# EAGLE design power electronics6 (EAGLE 9.2.2)
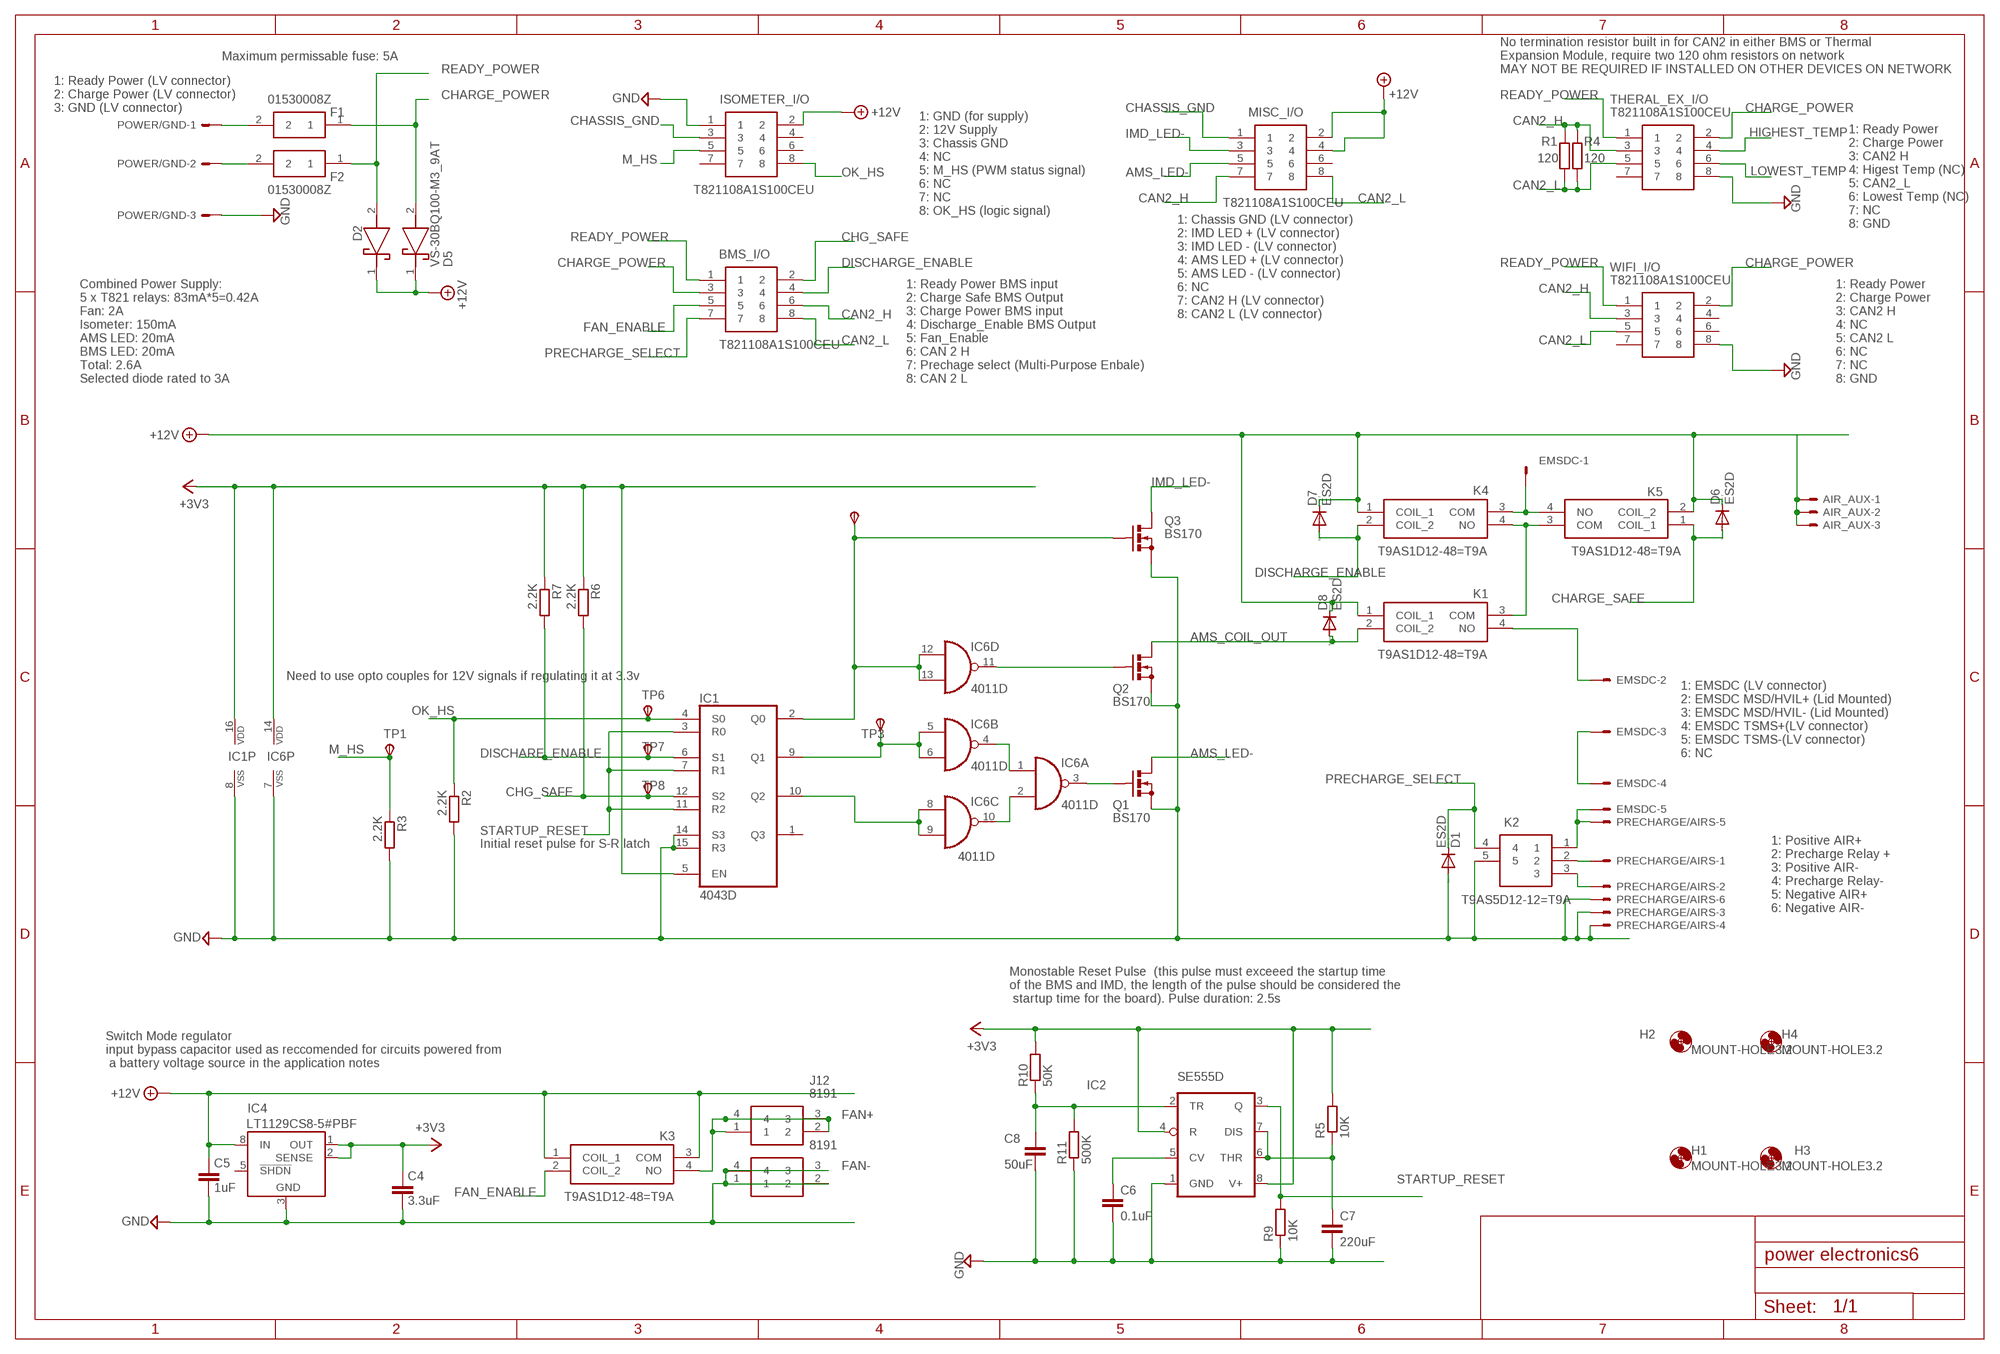
[diagram p0: schematic, sheet 1]

## Parts
AIR_AUX  KK-156-3  [KK-156-3]
BMS_I/O  T821108A1S100CEU  [HDRV8W64P254_2X4_1778X895X915P]
C4  3.3uF  C-EUC1206  [C1206]
C5  1uF  C-EUC1206  [C1206]
C6  0.1uF  C-EUC1206  [C1206]
C7  220uF  C-EUC1206  [C1206]
C8  50uF  C-EUC1206  [C1206]
D1  ES2D  [SMB]
D2  VS-30BQ100-M3_9AT  [DIOM7959X262N]
D5  VS-30BQ100-M3_9AT  [DIOM7959X262N]
D6  ES2D  [SMB]
D7  ES2D  [SMB]
D8  ES2D  [SMB]
EMSDC  KK-156-6  [KK-156-6]
F1  01530008Z  [01530008]
F2  01530008Z  [01530008]
FAN-  8191  [8191]
H1  MOUNT-HOLE3.2  [3,2]
H2  MOUNT-HOLE3.2  [3,2]
H3  MOUNT-HOLE3.2  [3,2]
H4  MOUNT-HOLE3.2  [3,2]
IC1  4043D  [SO16]
IC2  SE555D  [SO08]
IC4  LT1129CS8  [SOIC8]
IC6  4011D  [SO14]
ISOMETER_I/O  T821108A1S100CEU  [HDRV8W64P254_2X4_1778X895X915P]
J12  8191  [8191]
K1  T9AS1D12-48=T9A  [T9AS1D1248T9A]
K2  T9AS5D12-12=T9A  [T9AS1D12]
K3  T9AS1D12-48=T9A  [T9AS1D1248T9A]
K4  T9AS1D12-48=T9A  [T9AS1D1248T9A]
K5  T9AS1D12-48=T9A  [T9AS1D1248T9A]
MISC_I/O  T821108A1S100CEU  [HDRV8W64P254_2X4_1778X895X915P]
POWER/GND  KK-156-3  [KK-156-3]
PRECHARGE/AIRS  KK-156-6  [KK-156-6]
Q1  BS170  [SOT54E]
Q2  BS170  [SOT54E]
Q3  BS170  [SOT54E]
R1  120  R-EU_R1206  [R1206]
R2  2.2K  R-EU_R1206  [R1206]
R3  2.2K  R-EU_R1206  [R1206]
R4  120  R-EU_R1206  [R1206]
R5  10K  R-EU_R1206  [R1206]
R6  2.2K  R-EU_R1206  [R1206]
R7  2.2K  R-EU_R1206  [R1206]
R9  10K  R-EU_R1206  [R1206]
R10  50K  R-EU_R1206  [R1206]
R11  500K  R-EU_R1206  [R1206]
THERAL_EX_I/O  T821108A1S100CEU  [HDRV8W64P254_2X4_1778X895X915P]
TP1  TPSPAD1-17  [P1-17]
TP2  TPSPAD1-17  [P1-17]
TP3  TPSPAD1-17  [P1-17]
TP6  TPSPAD1-17  [P1-17]
TP7  TPSPAD1-17  [P1-17]
TP8  TPSPAD1-17  [P1-17]
WIFI_I/O  T821108A1S100CEU  [HDRV8W64P254_2X4_1778X895X915P]

## Nets
+3V3: C4.1 IC1.5(EN) IC1.16(VDD) IC2.4(R) IC2.8(V+) IC4.1(OUT) IC4.2(SENSE) IC6.14(P:VDD) R5.2 R6.1 R7.1 R10.2
+12V: AIR_AUX.1 AIR_AUX.2 AIR_AUX.3 C5.1 D2.1(K) D5.1(K) D6.C D7.C D8.C IC4.8(IN) ISOMETER_I/O.2 K1.1(COIL_1) K3.1(COIL_1) K3.3(COM) K4.1(COIL_1) K5.2(COIL_2) MISC_I/O.2 MISC_I/O.4
AMS_COIL_OUT: D8.A K1.2(COIL_2) Q2.D
AMS_LED-: MISC_I/O.5 Q1.D
CAN2_H: BMS_I/O.6 MISC_I/O.7 R1.1 R4.1 THERAL_EX_I/O.3 WIFI_I/O.3
CAN2_L: BMS_I/O.8 MISC_I/O.8 R1.2 R4.2 THERAL_EX_I/O.5 WIFI_I/O.5
CHARGE_POWER: BMS_I/O.3 D5.2(A) F1.1 THERAL_EX_I/O.2 WIFI_I/O.2
CHARGE_SAFE: D6.A K5.1(COIL_1)
CHASSIS_GND: ISOMETER_I/O.3 MISC_I/O.1
CHG_SAFE: BMS_I/O.2 IC1.12(S2) R6.2 TP8.TP(PP)
DISCHARE_ENABLE: IC1.6(S1) R7.2 TP7.TP(PP)
DISCHARGE_ENABLE: BMS_I/O.4 D7.A K4.2(COIL_2)
EMSDC_IMD+: K1.3(COM) K4.4(NO) K5.3(COM)
FAN+: J12.1 J12.2 J12.3 J12.4 K3.4(NO)
FAN_ENABLE: BMS_I/O.5 K3.2(COIL_2)
GND: C4.2 C5.2 C6.2 C7.2 C8.2 D1.A FAN-.1 FAN-.2 FAN-.3 FAN-.4 IC1.8(VSS) IC1.14(S3) IC1.15(R3) IC2.1(GND) IC4.3(GND) IC6.7(P:VSS) ISOMETER_I/O.1 K2.5 POWER/GND.3 PRECHARGE/AIRS.3 PRECHARGE/AIRS.4 PRECHARGE/AIRS.6 Q1.S Q2.S Q3.S R2.2 R3.2 R9.1 R11.1 THERAL_EX_I/O.8 WIFI_I/O.8
HIGHEST_TEMP: THERAL_EX_I/O.4
IMD_LED-: MISC_I/O.3 Q3.D
LOWEST_TEMP: THERAL_EX_I/O.6
M_HS: ISOMETER_I/O.5 R3.1 TP1.TP(PP)
N$1: EMSDC.1 K4.3(COM) K5.4(NO)
N$2: F2.2 POWER/GND.2
N$3: K2.2 PRECHARGE/AIRS.1
N$4: F1.2 POWER/GND.1
N$8: IC1.2(Q0) IC6.12(D:I0) IC6.13(D:I1) Q3.G TP2.TP(PP)
N$10: IC1.9(Q1) IC6.5(B:I0) IC6.6(B:I1) TP3.TP(PP)
N$11: EMSDC.5 K2.1 PRECHARGE/AIRS.5
N$12: K2.3 PRECHARGE/AIRS.2
N$13: IC1.10(Q2) IC6.8(C:I0) IC6.9(C:I1)
N$14: IC6.1(A:I0) IC6.4(B:O)
N$15: EMSDC.2 K1.4(NO)
N$17: C7.1 IC2.6(THR) IC2.7(DIS) R5.1
N$19: EMSDC.3 EMSDC.4
N$20: IC6.2(A:I1) IC6.10(C:O)
N$21: IC6.3(A:O) Q1.G
N$28: C8.1 IC2.2(TR) R10.1 R11.2
N$32: C6.1 IC2.5(CV)
N$37: IC6.11(D:O) Q2.G
OK_HS: IC1.4(S0) ISOMETER_I/O.8 R2.1 TP6.TP(PP)
PRECHARGE_SELECT: BMS_I/O.7 D1.C K2.4
READY_POWER: BMS_I/O.1 D2.2(A) F2.1 THERAL_EX_I/O.1 WIFI_I/O.1
STARTUP_RESET: IC1.3(R0) IC1.7(R1) IC1.11(R2) IC2.3(Q) R9.2
Unconnected: EMSDC.6 IC1.1(Q3) IC4.4(NC) IC4.5(!SHDN) ISOMETER_I/O.4 ISOMETER_I/O.6 ISOMETER_I/O.7 MISC_I/O.6 THERAL_EX_I/O.7 WIFI_I/O.4 WIFI_I/O.6 WIFI_I/O.7

## Notes on the sheet
- Maximum permissable fuse: 5A
- No termination resistor built in for CAN2 in either BMS or Thermal
  Expansion Module, require two 120 ohm resistors on network
  MAY NOT BE REQUIRED IF INSTALLED ON OTHER DEVICES ON NETWORK
- 1: Ready Power (LV connector)
  2: Charge Power (LV connector)
  3: GND (LV connector)
- 1: GND (for supply) 
  2: 12V Supply
  3: Chassis GND 
  4: NC 
  5: M_HS (PWM status signal)
  6: NC
  7: NC
  8: OK_HS (logic signal)
- 1: Ready Power
  2: Charge Power
  3: CAN2 H
  4: Higest Temp (NC)
  5: CAN2_L
  6: Lowest Temp (NC)
  7: NC
  8: GND
- 1: Chassis GND (LV connector)
  2: IMD LED + (LV connector)
  3: IMD LED - (LV connector)
  4: AMS LED + (LV connector)
  5: AMS LED - (LV connector)
  6: NC
  7: CAN2 H (LV connector)
  8: CAN2 L (LV connector)
- Combined Power Supply:
  5 x T821 relays: 83mA*5=0.42A
  Fan: 2A
  Isometer: 150mA
  AMS LED: 20mA
  BMS LED: 20mA
  Total: 2.6A
  Selected diode rated to 3A
- 1: Ready Power BMS input
  2: Charge Safe BMS Output 
  3: Charge Power BMS input
  4: Discharge_Enable BMS Output
  5: Fan_Enable
  6: CAN 2 H
  7: Prechage select (Multi-Purpose Enbale)
  8: CAN 2 L
- 1: Ready Power
  2: Charge Power
  3: CAN2 H
  4: NC
  5: CAN2 L
  6: NC
  7: NC
  8: GND
- Need to use opto couples for 12V signals if regulating it at 3.3v
- 1: EMSDC (LV connector)
  2: EMSDC MSD/HVIL+ (Lid Mounted)
  3: EMSDC MSD/HVIL- (Lid Mounted)
  4: EMSDC TSMS+(LV connector)
  5: EMSDC TSMS-(LV connector)
  6: NC
- Initial reset pulse for S-R latch
- 1: Positive AIR+
  2: Precharge Relay +
  3: Positive AIR-
  4: Precharge Relay-
  5: Negative AIR+
  6: Negative AIR-
- Monostable Reset Pulse  (this pulse must exceeed the startup time 
  of the BMS and IMD, the length of the pulse should be considered the
   startup time for the board). Pulse duration: 2.5s
- Switch Mode regulator
  input bypass capacitor used as reccomended for circuits powered from
   a battery voltage source in the application notes

## Power pins joined to a net without a drawn wire
GND: IC4.6(GND) IC4.7(GND)

## Library data of the parts
AIR_AUX POWER/GND = con-molex:KK-156-3: KK 156 HEADER Source: http://www.molex.com/pdm_docs/sd/026604100_sd.pdf; MF: MOLEX; OC_FARNELL: unknown; OC_NEWARK: unknown
BMS_I/O ISOMETER_I/O MISC_I/O THERAL_EX_I/O WIFI_I/O = SamacSys_Parts:T821108A1S100CEU: HEADER, VERTICAL, 2.54MM, 8WAY Amphenol T821 Series, 2.54mm Pitch 8 Way 2 Row Straight PCB Header, Solder Termination, 3A Source: Datasheet <http://uk.rs-online.com/web/p/products/8323569>; DESCRIPTION: HEADER, VERTICAL, 2.54MM, 8WAY Amphenol T821 Series, 2.54mm Pitch 8 Way 2 Row Straight PCB Header, Solder Termination, 3A; HEIGHT: 9.15mm; MANUFACTURER_NAME: Amphenol; MANUFACTURER_PART_NUMBER: T821108A1S100CEU; RS_PART_NUMBER: 8323569; RS_PRICE-STOCK: http://uk.rs-online.com/web/p/products/8323569
C4-C8 = rcl:C-EU: CAPACITOR, European symbol; SPICEPREFIX: C
D1 D6-D8 = diode:ES2D: DIODE super fast rectifier, 2 A
D2 D5 = SamacSys_Parts:VS-30BQ100-M3_9AT: Vishay VS-30BQ100-M3/9AT SMT Schottky Diode, 100V 3A, 2-Pin DO-214AB Source: Datasheet <https://componentsearchengine.com/Datasheets/1/VS-30BQ100-M3_9AT.pdf>; DESCRIPTION: Vishay VS-30BQ100-M3/9AT SMT Schottky Diode, 100V 3A, 2-Pin DO-214AB; HEIGHT: 2.62mm; MANUFACTURER_NAME: Vishay; MANUFACTURER_PART_NUMBER: VS-30BQ100-M3/9AT; MOUSER_PART_NUMBER: 78-VS-30BQ100-M39AT; MOUSER_PRICE-STOCK: https://www.mouser.com/Search/Refine.aspx?Keyword=78-VS-30BQ100-M39AT
EMSDC PRECHARGE/AIRS = con-molex:KK-156-6: KK 156 HEADER Source: http://www.molex.com/pdm_docs/sd/026604100_sd.pdf; MF: MOLEX; OC_FARNELL: unknown; OC_NEWARK: unknown
F1 F2 = SamacSys_Parts:01530008Z: Mini fuseholder,15A 32V Littelfuse 15A PCB Mount Fuse Holder Automotive Fuse, 32 V Source: Datasheet <http://www.littelfuse.com/data/en/data_sheets/153_pcmount.pdf>; ALLIED_NUMBER: 70184304; DESCRIPTION: Mini fuseholder,15A 32V Littelfuse 15A PCB Mount Fuse Holder Automotive Fuse, 32 V; HEIGHT: mm; MANUFACTURER_NAME: LITTELFUSE; MANUFACTURER_PART_NUMBER: 01530008Z; RS_PART_NUMBER: 3607317; RS_PRICE-STOCK: https://uk.rs-online.com/web/p/products/3607317
FAN- J12 = SamacSys_Parts:8191: Screw terminal, PC mount, vertical, with screw, metal, 15 Amps Source: Datasheet <http://www.keyelco.com/product-pdf.cfm?p=1517>; ALLIED_NUMBER: 70181569; ALLIED_PRICE-STOCK: https://www.alliedelec.com/keystoneelectronics-8191/70181569/; DESCRIPTION: Screw terminal, PC mount, vertical, with screw, metal, 15 Amps; HEIGHT: 6.56mm; MANUFACTURER_NAME: Keystone Electronics; MANUFACTURER_PART_NUMBER: 8191; MOUSER_PART_NUMBER: 534-8191; MOUSER_PRICE-STOCK: https://www.mouser.com/Search/Refine.aspx?Keyword=534-8191; RS_PART_NUMBER: 1194011; RS_PRICE-STOCK: http://uk.rs-online.com/web/p/products/1194011
H1-H4 = holes:MOUNT-HOLE: MOUNTING HOLE with drill center marker
IC1 = 40xx:4043: Quad 3-state NOR R/S LATCH
IC2 = linear:*555: TIMER
IC4 = linear-technology:LT1129CS8: VOLTAGE REGULATOR with shutdown; MPN: LT1129CS8-5#PBF; OC_FARNELL: 1273576; OC_NEWARK: 57M2078
IC6 = 40xx:4011: Quad 2-input NAND
K1 K3-K5 = SamacSys_Parts:T9AS1D12-48=T9A: SPST-NO PCB Mount Non-Latching Relay Through Hole, 48V dc Source: Datasheet <http://uk.rs-online.com/web/p/products/6802534P>; DESCRIPTION: SPST-NO PCB Mount Non-Latching Relay Through Hole, 48V dc; HEIGHT: 20.4mm; MANUFACTURER_NAME: TE Connectivity; MANUFACTURER_PART_NUMBER: T9AS1D12-48=T9A; RS_PART_NUMBER: 6802534P; RS_PRICE-STOCK: http://uk.rs-online.com/web/p/products/6802534P
K2 = SamacSys_Parts:T9AS5D12-12=T9A: PCB Relay SPDT 30A 12Vdc,thru hole SPDT PCB Mount Non-Latching Relay Through Hole, 12V dc Source: Datasheet; ALLIED_NUMBER: R1111589; DESCRIPTION: PCB Relay SPDT 30A 12Vdc,thru hole SPDT PCB Mount Non-Latching Relay Through Hole, 12V dc; HEIGHT: mm; MANUFACTURER_NAME: TE Connectivity; MANUFACTURER_PART_NUMBER: T9AS5D12-12=T9A; RS_PART_NUMBER: 6802528; RS_PRICE-STOCK: https://uk.rs-online.com/web/p/products/6802528
Q1-Q3 = transistor-small-signal:BS170: N-CHANNEL MOS FET
R1-R7 R9-R11 = rcl:R-EU_: RESISTOR, European symbol; SPICEPREFIX: R
TP1-TP3 TP6-TP8 = testpad:TPS: TEST PIN

## Board
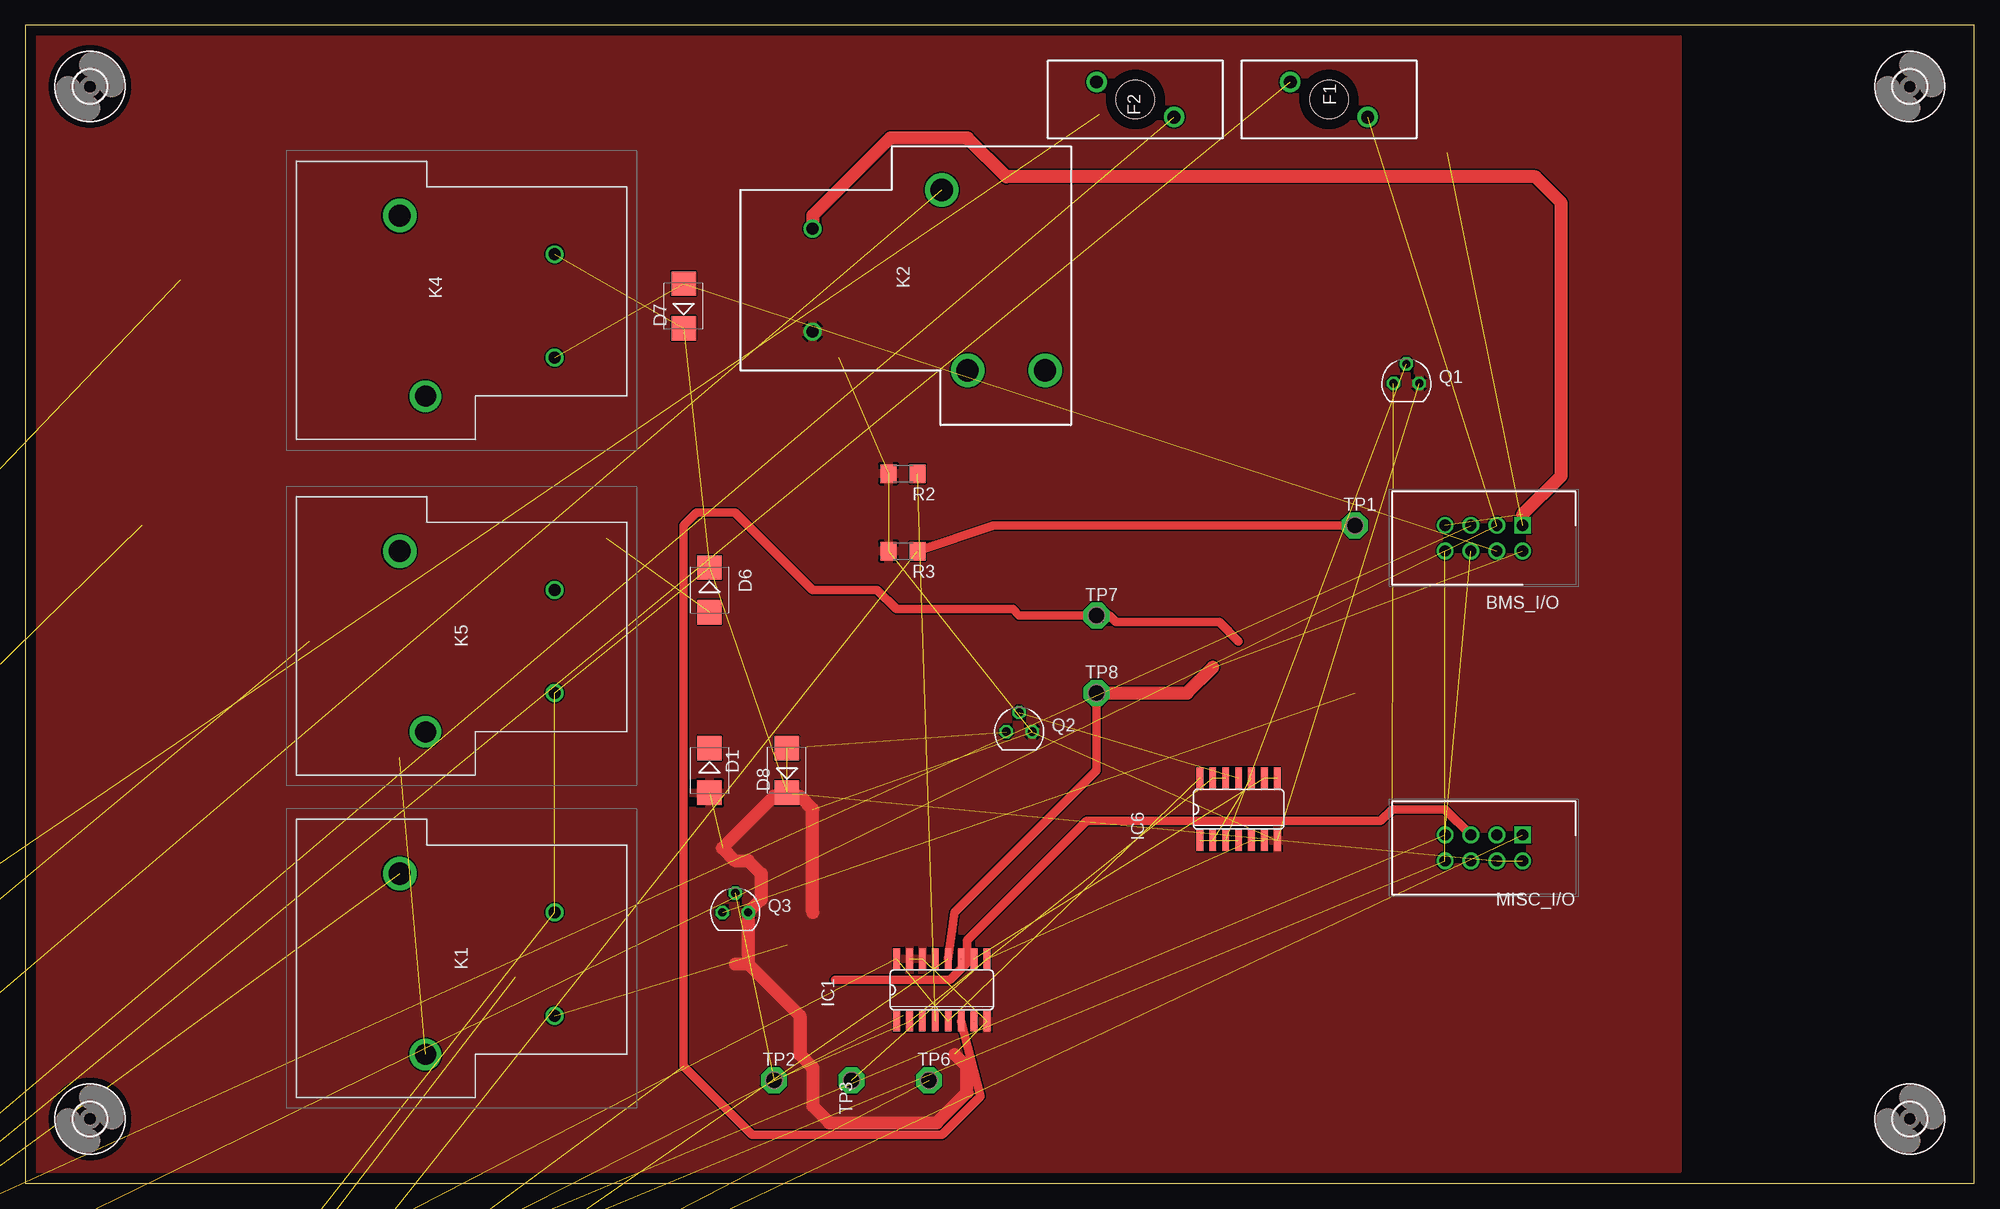
[diagram p1: board, top side]
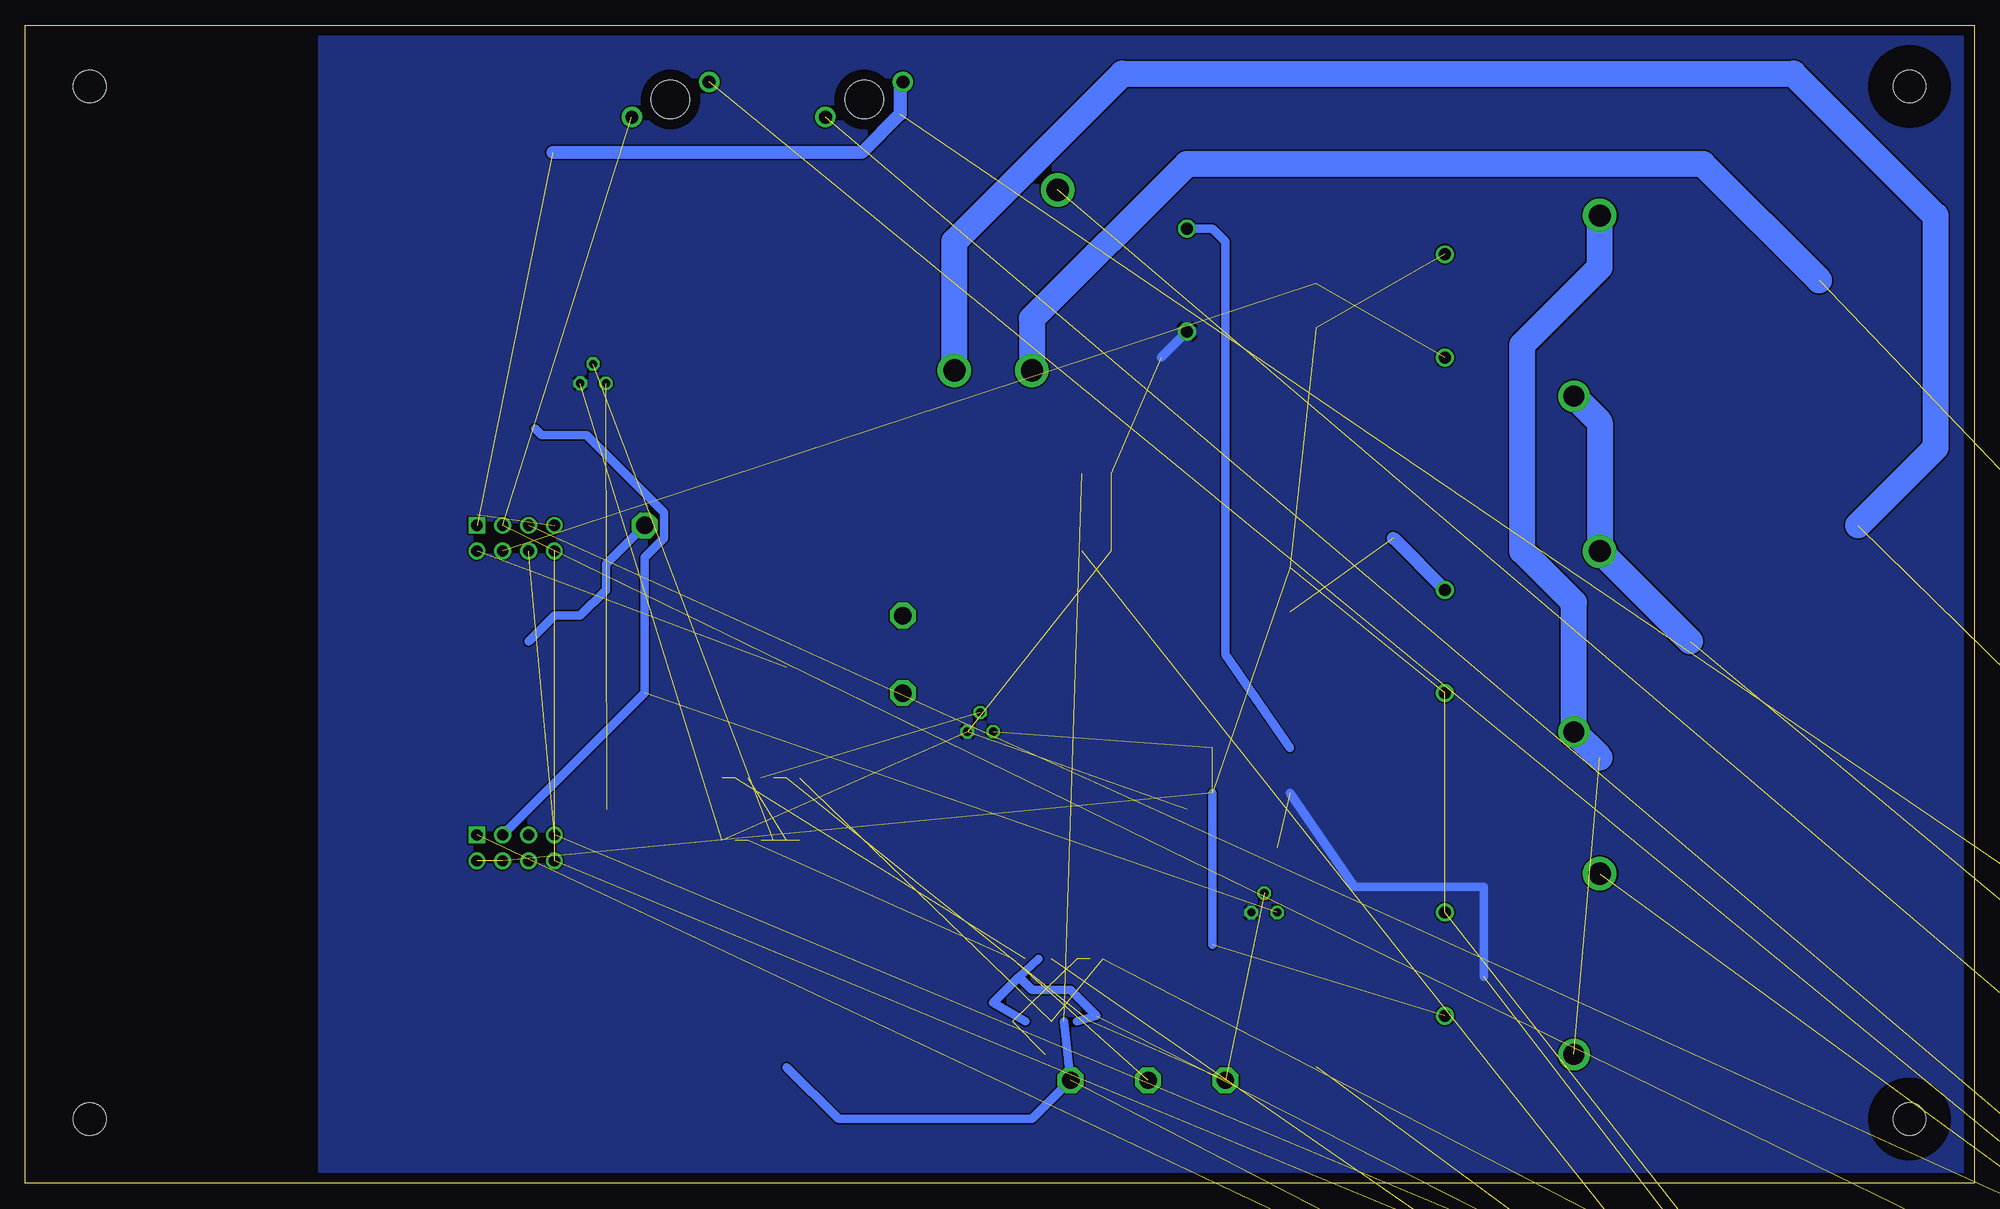
[diagram p2: board, bottom side, seen from below]

Size 191.75 x 113.97 mm. Coordinates in mm from the lower left corner, seen from the top.
Outline: 0,0 191.75,0 191.75,113.97 0,113.97 0,0
Copper layers (1*16): Top 0.035mm / dielectric 1.5mm / Bottom 0.035mm
Design rules "default": minimum track width 6mil, minimum drill 0.35mm, track to track 6mil, track to pad 6mil, pad to pad 6mil, via to via 6mil, smd to smd 6mil, copper to edge 40mil, drill to drill 6mil, minimum pad ring 10mil, minimum via ring 8mil, stop-mask expansion 4mil, vias tented up to drill 0mil, thermal gap 10mil

### Footprints (pad centres in the part's own frame; a part is rotated, then mirrored left to right if it is on the bottom)
KK-156-3 = drill 1.7 pad 2.184 long: 1 -3.96,0; 2 0,0; 3 3.96,0
HDRV8W64P254_2X4_1778X895X915P = drill 1.1 pad 1.65 square: 1 0,0 | drill 1.1 pad 1.65: 2 0,2.54; 3 2.54,0; 4 2.54,2.54; 5 5.08,0; 6 5.08,2.54; 7 7.62,0; 8 7.62,2.54
C1206 = smd 1.6 x 1.8: 1 -1.4,0; 2 1.4,0
SMB = smd 2.4 x 2.4: A 2.2,0; C -2.2,0
DIOM7959X262N = smd 2.2 x 3.15: 1 -3.5,0; 2 3.5,0
KK-156-6 = drill 1.7 pad 2.184 long: 1 -9.9,0; 2 -5.94,0; 3 -1.98,0; 4 1.98,0; 5 5.94,0; 6 9.9,0
01530008 = drill 1.27 pad 2: 1 1.727,3.81; 2 -1.727,-3.81 | hole 3.785: 0,0
8191 = drill 1.85 pad 2.775: 1 0,0; 2 5,0; 3 5,7.01; 4 0,7.01
3,2 = hole 3.2: 0,0
SO16 = smd 0.66 x 2.032: 1 -4.445,-3.073; 2 -3.175,-3.073; 3 -1.905,-3.073; 4 -0.635,-3.073; 5 0.635,-3.073; 6 1.905,-3.073; 7 3.175,-3.073; 8 4.445,-3.073; 9 4.445,3.073; 10 3.175,3.073; 11 1.905,3.073; 12 0.635,3.073; 13 -0.635,3.073; 14 -1.905,3.073; 15 -3.175,3.073; 16 -4.445,3.073
SO08 = smd 0.6 x 2.2: 1 -1.905,-2.6; 2 -0.635,-2.6; 3 0.635,-2.6; 4 1.905,-2.6; 5 1.905,2.6; 6 0.635,2.6; 7 -0.635,2.6; 8 -1.905,2.6
SOIC8 = smd 0.6 x 2.2: 1 -1.905,-2.6; 2 -0.635,-2.6; 3 0.635,-2.6; 4 1.905,-2.6; 5 1.905,2.6; 6 0.635,2.6; 7 -0.635,2.6; 8 -1.905,2.6
SO14 = smd 0.66 x 2.032: 1 -3.81,-3.073; 2 -2.54,-3.073; 3 -1.27,-3.073; 4 0,-3.073; 5 1.27,-3.073; 6 2.54,-3.073; 7 3.81,-3.073; 8 3.81,3.073; 9 2.54,3.073; 10 1.27,3.073; 11 0,3.073; 12 -1.27,3.073; 13 -2.54,3.073; 14 -3.81,3.073
T9AS1D1248T9A = drill 1.17 pad 1.755: 1 0,0; 2 -10.16,0 | drill 2.06 pad 3.09: 3 -13.97,12.7 | drill 2.19 pad 3.3: 4 3.81,15.24
T9AS1D12 = drill 2.19 pad 3.29: 1 -8.89,12.7; 2 8.89,15.24; 3 8.89,22.86 | drill 1.17 pad 1.77: 4 -5.08,0; 5 5.08,0
SOT54E = drill 0.813 octagon: D -1.27,0; G 0,1.905; S 1.27,0
R1206 = smd 1.6 x 1.803: 1 -1.422,0; 2 1.422,0
P1-17 = drill 1.702 pad 2.54 octagon: TP 0,0

### Placement (x,y rotation side)
AIR_AUX  -226.06,-191.77 0 top  (outside the outline)
BMS_I/O  147.32,64.77 180 top
C4  -16.51,-36.83 0 top  (outside the outline)
C5  -16.51,-43.18 0 top  (outside the outline)
C6  -43.18,-54.61 0 top  (outside the outline)
C7  -43.18,-60.96 0 top  (outside the outline)
C8  -43.18,-86.36 0 top  (outside the outline)
D1  67.31,40.64 270 top
D2  -220.98,-144.78 0 top  (outside the outline)
D5  -224.79,-152.4 0 top  (outside the outline)
D6  67.31,58.42 270 top
D7  64.77,86.36 90 top
D8  74.93,40.64 90 top
EMSDC  -219.71,-161.29 0 top  (outside the outline)
F1  128.27,106.68 270 top
F2  109.22,106.68 90 top
FAN-  -218.44,-92.71 0 top  (outside the outline)
H1  185.42,6.35 0 top
H2  185.42,107.95 0 top
H3  6.35,6.35 0 top
H4  6.35,107.95 0 top
IC1  90.17,19.05 0 top
IC2  -41.91,-45.72 0 top  (outside the outline)
IC4  -15.24,-27.94 0 top  (outside the outline)
IC6  119.38,36.83 0 top
ISOMETER_I/O  10.16,-29.21 0 top  (outside the outline)
J12  -208.28,-92.71 0 top  (outside the outline)
K1  52.07,26.67 90 top
K2  77.47,88.9 270 top
K3  -180.34,-86.36 0 top  (outside the outline)
K4  52.07,91.44 90 top
K5  52.07,58.42 90 top
MISC_I/O  147.32,34.29 180 top
POWER/GND  -224.79,-181.61 0 top  (outside the outline)
PRECHARGE/AIRS  -223.52,-171.45 0 top  (outside the outline)
Q1  135.89,78.74 0 top
Q2  97.79,44.45 0 top
Q3  69.85,26.67 0 top
R1  -223.52,-130.81 0 top  (outside the outline)
R2  86.36,69.85 180 top
R3  86.36,62.23 180 top
R4  -223.52,-137.16 0 top  (outside the outline)
R5  -43.18,-67.31 0 top  (outside the outline)
R6  -232.41,-200.66 0 top  (outside the outline)
R7  -232.41,-207.01 0 top  (outside the outline)
R9  -43.18,-73.66 0 top  (outside the outline)
R10  -43.18,-80.01 0 top  (outside the outline)
R11  -43.18,-92.71 0 top  (outside the outline)
THERAL_EX_I/O  -214.63,-113.03 0 top  (outside the outline)
TP1  130.81,64.77 0 top
TP2  73.66,10.16 0 top
TP3  81.28,10.16 270 top
TP6  88.9,10.16 0 top
TP7  105.41,55.88 0 top
TP8  105.41,48.26 0 top
WIFI_I/O  -217.17,-123.19 0 top  (outside the outline)

### Tracks (layer width: path | path; a pad name or v marks a point on that pad's centre or on a via)
+3V3  (11 unrouted)
+12V  (17 unrouted)
AMS_COIL_OUT  (3 unrouted)
  Bottom 0.813: 74.93,38.44 74.93,23.5
AMS_LED-  (1 unrouted)
  Top 0.813: 79.68,20.02 90.98,20.02 92.66,21.7 92.66,23.92 104.41,35.67 133.35,35.67 134.51,36.83 139.7,36.83 MISC_I/O.5
CAN2_H  (5 unrouted)
CAN2_L  (5 unrouted)
CHARGE_POWER  (4 unrouted)
CHARGE_SAFE  (1 unrouted)
  Bottom 1.27: K5.1 57.15,63.5
CHASSIS_GND  (1 unrouted)
CHG_SAFE  (2 unrouted)
  Top 0.813: IC1.12 91.44,26.67 105.41,40.64 TP8.TP
  Top 1.27: TP8.TP 114.3,48.26 116.84,50.8
DISCHARE_ENABLE  (1 unrouted)
  Top 0.813: IC1.6 93.98,8.59 90.17,4.78 71.52,4.78 64.77,11.53 64.77,64.77 66.04,66.04 69.85,66.04 77.47,58.42 83.82,58.42 85.72,56.52 97.16,56.52 97.79,55.88 TP7.TP 106.68,55.88 107.31,55.24 117.47,55.24 119.38,53.34
DISCHARGE_ENABLE  (2 unrouted)
EMSDC_IMD+  (1 unrouted)
  Bottom 2.54: 36.83,41.91 K5.3 39.37,57.15 44.45,62.23 44.45,82.55 36.83,90.17 K4.4
FAN+  (4 unrouted)
FAN_ENABLE  (1 unrouted)
GND  (33 unrouted)
  Top 1.27: 77.47,26.67 77.47,36.83 76.2,38.1 73.66,38.1 68.58,33.02 69.85,31.75 71.12,31.75 72.39,30.48 72.39,27.94 Q3.S 71.12,21.59 | 69.85,21.59 71.12,21.59 | 71.12,21.59 76.2,16.51 76.2,12.7 77.47,11.43 77.47,7.62 79.12,5.97 89.68,5.97 92.65,8.95 92.65,11.49 91.44,12.7
  Bottom 0.813: 48.26,20.32 48.26,29.21 60.96,29.21 D1.A | K2.5 80.01,81.28
  pour Bottom: 1.27,113.03 162.56,113.03 162.56,1.27 1.27,1.27
  pour Top: 1.27,1.27 162.56,1.27 162.56,113.03 1.27,113.03
IMD_LED-  (1 unrouted)
  Bottom 0.813: MISC_I/O.3 130.81,48.26 130.81,61.59 128.91,63.5 128.91,66.04 136.53,73.66 140.97,73.66 141.6,74.3
M_HS  (1 unrouted)
  Top 0.813: R3.1 95.25,64.77 TP1.TP
  Bottom 0.813: TP1.TP 134.62,60.96 134.62,58.42 137.16,55.88 139.7,55.88 142.24,53.34
N$1  (1 unrouted)
  Bottom 2.54: K4.3 36.83,74.93 K5.4 27.94,53.34
N$2  (1 unrouted)
N$3  (1 unrouted)
  Bottom 2.54: 15.24,88.9 26.67,100.33 77.47,100.33 92.71,85.09 K2.2
N$4  (1 unrouted)
N$8  (4 unrouted)
N$10  (3 unrouted)
N$11  (2 unrouted)
N$12  (1 unrouted)
  Bottom 2.54: K2.3 100.33,92.71 83.82,109.22 17.78,109.22 3.81,95.25 3.81,72.39 11.43,64.77
N$13  (2 unrouted)
N$14  (1 unrouted)
N$15  (1 unrouted)
N$17  (3 unrouted)
N$19  (1 unrouted)
N$20  (1 unrouted)
N$21  (1 unrouted)
N$28  (3 unrouted)
N$32  (1 unrouted)
N$37  (1 unrouted)
OK_HS  (2 unrouted)
  Bottom 0.813: IC1.4 TP6.TP 92.71,6.35 111.76,6.35 116.84,11.43
PRECHARGE_SELECT  (2 unrouted)
  Top 1.27: 147.32,65.83 151.13,69.64 151.13,96.52 148.59,99.06 96.52,99.06 92.71,102.87 85.09,102.87 77.47,95.25 K2.4
  Bottom 0.813: D1.C 73.66,52.07 73.66,92.71 74.93,93.98 K2.4
READY_POWER  (4 unrouted)
  Bottom 1.27: F2.1 105.68,108.14 105.68,105.21 109.44,101.45 139.85,101.45
STARTUP_RESET  (5 unrouted)
  Bottom 0.813: IC1.3 86.36,16.51 88.9,19.05 92.71,19.05 93.98,20.32 | IC1.11 93.98,20.32 | IC1.7 96.52,17.78 93.98,20.32